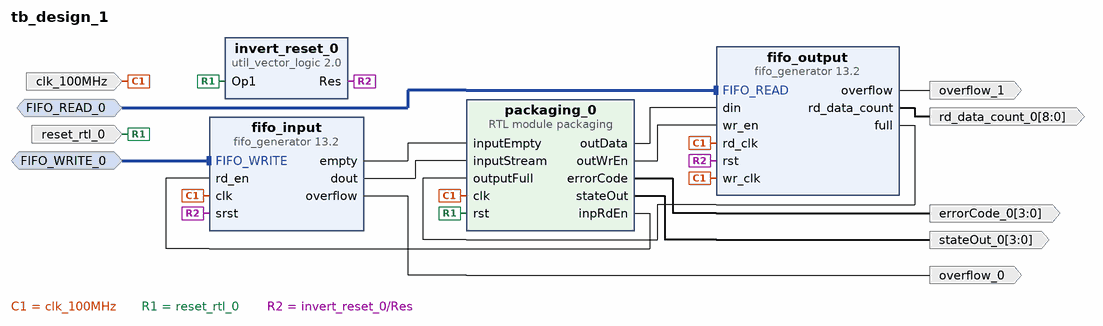
[diagram p0: block diagram of the top level]
# Vivado block design tb_design_1, xc7a100tcsg324-1, Vivado 2018.3
create_bd_design tb_design_1

create_bd_intf_port -mode Slave -vlnv xilinx.com:interface:fifo_write_rtl:1.0 FIFO_WRITE_0
create_bd_intf_port -mode Slave -vlnv xilinx.com:interface:fifo_read_rtl:1.0 FIFO_READ_0
create_bd_port -dir I -type clk clk_100MHz
set_property -dict {CONFIG.ASSOCIATED_RESET reset_rtl_0 CONFIG.PHASE 0.0} [get_bd_ports clk_100MHz]
create_bd_port -dir I -type rst reset_rtl_0
create_bd_port -dir O overflow_0
create_bd_port -dir O overflow_1
create_bd_port -dir O -from 3 -to 0 stateOut_0
create_bd_port -dir O -from 3 -to 0 errorCode_0
create_bd_port -dir O -from 8 -to 0 rd_data_count_0

create_bd_cell -type ip -vlnv xilinx.com:ip:fifo_generator:13.2 fifo_input
set_property -dict [list \
  CONFIG.Almost_Empty_Flag false \
  CONFIG.Data_Count false \
  CONFIG.FIFO_Implementation_rach Common_Clock_Distributed_RAM \
  CONFIG.FIFO_Implementation_wach Common_Clock_Distributed_RAM \
  CONFIG.FIFO_Implementation_wrch Common_Clock_Distributed_RAM \
  CONFIG.Fifo_Implementation Common_Clock_Distributed_RAM \
  CONFIG.INTERFACE_TYPE Native \
  CONFIG.Input_Data_Width 32 \
  CONFIG.Input_Depth 64 \
  CONFIG.Overflow_Flag true \
  CONFIG.Performance_Options Standard_FIFO \
  CONFIG.Programmable_Empty_Type No_Programmable_Empty_Threshold \
  CONFIG.Programmable_Full_Type No_Programmable_Full_Threshold \
  CONFIG.Reset_Pin true \
  CONFIG.Reset_Type Synchronous_Reset \
  CONFIG.Underflow_Flag false \
  CONFIG.Use_Dout_Reset true \
  CONFIG.Valid_Flag false \
] [get_bd_cells fifo_input]
create_bd_cell -type ip -vlnv xilinx.com:ip:fifo_generator:13.2 fifo_output
set_property -dict [list \
  CONFIG.Almost_Empty_Flag false \
  CONFIG.Almost_Full_Flag false \
  CONFIG.FIFO_Implementation_rach Common_Clock_Distributed_RAM \
  CONFIG.FIFO_Implementation_wach Common_Clock_Distributed_RAM \
  CONFIG.FIFO_Implementation_wrch Common_Clock_Distributed_RAM \
  CONFIG.Fifo_Implementation Independent_Clocks_Distributed_RAM \
  CONFIG.Full_Flags_Reset_Value 1 \
  CONFIG.INTERFACE_TYPE Native \
  CONFIG.Input_Data_Width 32 \
  CONFIG.Input_Depth 512 \
  CONFIG.Overflow_Flag true \
  CONFIG.Performance_Options Standard_FIFO \
  CONFIG.Programmable_Empty_Type No_Programmable_Empty_Threshold \
  CONFIG.Programmable_Full_Type No_Programmable_Full_Threshold \
  CONFIG.Read_Data_Count true \
  CONFIG.Read_Data_Count_Width 9 \
  CONFIG.Reset_Pin true \
  CONFIG.Underflow_Flag false \
  CONFIG.Use_Dout_Reset true \
  CONFIG.Valid_Flag false \
  CONFIG.Write_Data_Count false \
] [get_bd_cells fifo_output]
create_bd_cell -type ip -vlnv xilinx.com:ip:util_vector_logic:2.0 invert_reset_0
set_property -dict {CONFIG.C_OPERATION not CONFIG.C_SIZE 1} [get_bd_cells invert_reset_0]
create_bd_cell -type module -reference packaging packaging_0

# ---- connections ----

connect_bd_intf_net -intf_net FIFO_READ_0_1 [get_bd_intf_ports FIFO_READ_0] [get_bd_intf_pins fifo_output/FIFO_READ]
connect_bd_intf_net [get_bd_intf_ports FIFO_WRITE_0] [get_bd_intf_pins fifo_input/FIFO_WRITE]
connect_bd_net -net clk_0_1 [get_bd_ports clk_100MHz] \
  [get_bd_pins fifo_input/clk] [get_bd_pins packaging_0/clk] [get_bd_pins fifo_output/rd_clk] \
  [get_bd_pins fifo_output/wr_clk]
connect_bd_net -net rst_0_1 [get_bd_ports reset_rtl_0] [get_bd_pins packaging_0/rst] [get_bd_pins invert_reset_0/Op1]
connect_bd_net [get_bd_pins invert_reset_0/Res] [get_bd_pins fifo_output/rst] [get_bd_pins fifo_input/srst]
connect_bd_net [get_bd_pins fifo_input/empty] [get_bd_pins packaging_0/inputEmpty]
connect_bd_net [get_bd_pins fifo_input/dout] [get_bd_pins packaging_0/inputStream]
connect_bd_net [get_bd_pins packaging_0/inpRdEn] [get_bd_pins fifo_input/rd_en]
connect_bd_net [get_bd_pins fifo_input/overflow] [get_bd_ports overflow_0]
connect_bd_net [get_bd_pins fifo_output/overflow] [get_bd_ports overflow_1]
connect_bd_net [get_bd_pins fifo_output/full] [get_bd_pins packaging_0/outputFull]
connect_bd_net [get_bd_pins packaging_0/outData] [get_bd_pins fifo_output/din]
connect_bd_net [get_bd_pins packaging_0/outWrEn] [get_bd_pins fifo_output/wr_en]
connect_bd_net [get_bd_pins packaging_0/stateOut] [get_bd_ports stateOut_0]
connect_bd_net [get_bd_pins packaging_0/errorCode] [get_bd_ports errorCode_0]
connect_bd_net [get_bd_pins fifo_output/rd_data_count] [get_bd_ports rd_data_count_0]

validate_bd_design
save_bd_design
